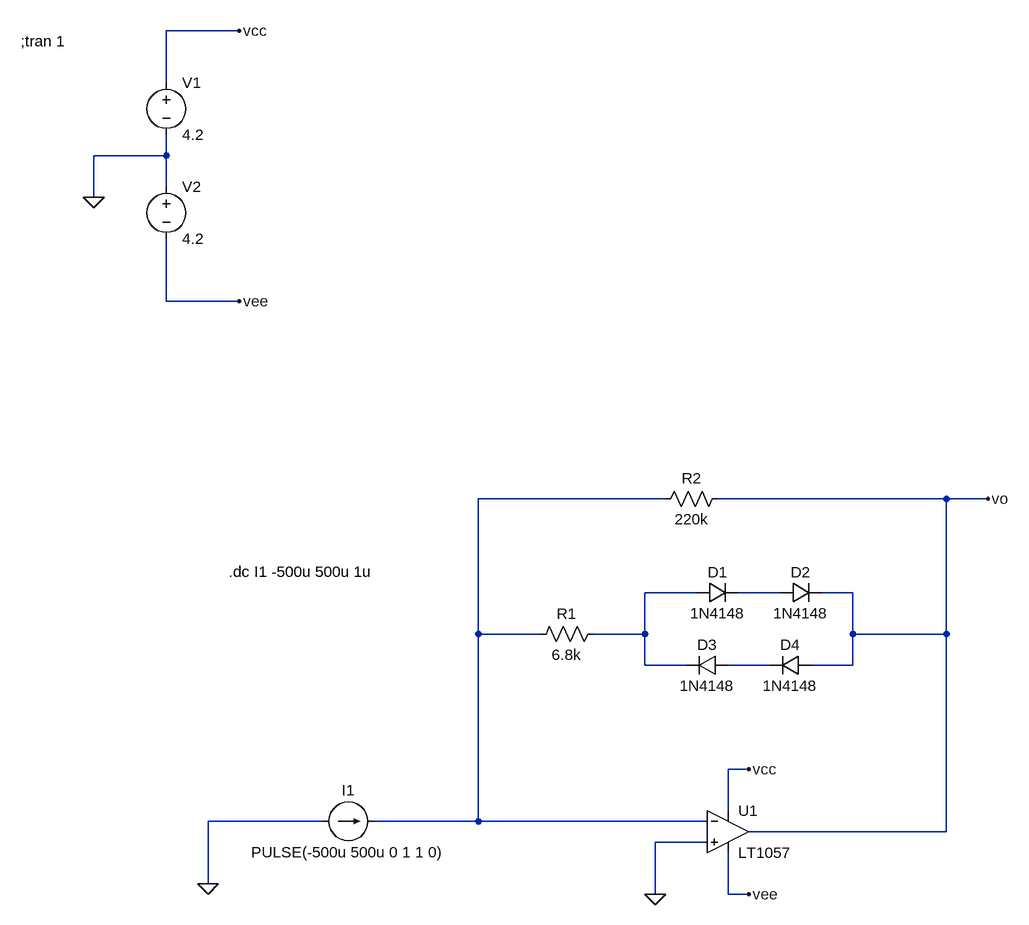
[diagram p0: schematic clipper_vi_curve.asc]
clipper_vi_curve.asc, the LTspice schematic file:
Version 4
SHEET 1 880 680
WIRE -608 -832 -720 -832
WIRE -720 -752 -720 -832
WIRE -720 -640 -720 -672
WIRE -720 -640 -832 -640
WIRE -720 -592 -720 -640
WIRE -832 -576 -832 -640
WIRE -720 -416 -720 -512
WIRE -608 -416 -720 -416
WIRE 48 -112 -240 -112
WIRE 480 -112 128 -112
WIRE 544 -112 480 -112
WIRE 96 32 16 32
WIRE 224 32 160 32
WIRE 336 32 288 32
WIRE -240 96 -240 -112
WIRE -144 96 -240 96
WIRE 16 96 16 32
WIRE 16 96 -64 96
WIRE 336 96 336 32
WIRE 480 96 480 -112
WIRE 480 96 336 96
WIRE 16 144 16 96
WIRE 80 144 16 144
WIRE 208 144 144 144
WIRE 336 144 336 96
WIRE 336 144 272 144
WIRE 176 304 144 304
WIRE 144 368 144 304
WIRE -480 384 -656 384
WIRE -240 384 -240 96
WIRE -240 384 -400 384
WIRE 112 384 -240 384
WIRE 480 400 480 96
WIRE 480 400 176 400
WIRE 112 416 32 416
WIRE -656 480 -656 384
WIRE 32 496 32 416
WIRE 144 496 144 432
WIRE 176 496 144 496
FLAG 32 496 0
FLAG 176 304 vcc
FLAG 176 496 vee
FLAG -656 480 0
FLAG -832 -576 0
FLAG -608 -832 vcc
FLAG -608 -416 vee
FLAG 544 -112 vo
SYMBOL diode 224 48 R270
WINDOW 0 32 32 VTop 2
WINDOW 3 0 32 VBottom 2
SYMATTR InstName D2
SYMATTR Value 1N4148
SYMBOL diode 96 48 R270
WINDOW 0 32 32 VTop 2
WINDOW 3 0 32 VBottom 2
SYMATTR InstName D1
SYMATTR Value 1N4148
SYMBOL diode 144 128 R90
WINDOW 0 0 32 VBottom 2
WINDOW 3 32 32 VTop 2
SYMATTR InstName D3
SYMATTR Value 1N4148
SYMBOL diode 272 128 R90
WINDOW 0 0 32 VBottom 2
WINDOW 3 32 32 VTop 2
SYMATTR InstName D4
SYMATTR Value 1N4148
SYMBOL res -48 80 R90
WINDOW 0 0 56 VBottom 2
WINDOW 3 32 56 VTop 2
SYMATTR InstName R1
SYMATTR Value 6.8k
SYMBOL res 144 -128 R90
WINDOW 0 0 56 VBottom 2
WINDOW 3 32 56 VTop 2
SYMATTR InstName R2
SYMATTR Value 220k
SYMBOL Opamps\\LT1057 144 336 R0
SYMATTR InstName U1
SYMBOL current -480 384 R270
WINDOW 0 32 40 VTop 2
WINDOW 3 -32 40 VBottom 2
WINDOW 123 0 0 Left 2
WINDOW 39 0 0 Left 2
SYMATTR InstName I1
SYMATTR Value PULSE(-500u 500u 0 1 1 0)
SYMBOL voltage -720 -768 R0
WINDOW 123 0 0 Left 2
WINDOW 39 0 0 Left 2
SYMATTR InstName V1
SYMATTR Value 4.2
SYMBOL voltage -720 -608 R0
WINDOW 123 0 0 Left 2
WINDOW 39 0 0 Left 2
SYMATTR InstName V2
SYMATTR Value 4.2
TEXT -944 -816 Left 2 !;tran 1
TEXT -624 0 Left 2 !.dc I1 -500u 500u 1u

The netlist it stands for:
* clipper_vi_curve.asc
D2 N003 vo 1N4148
D1 N002 N003 1N4148
D3 N004 N002 1N4148
D4 vo N004 1N4148
R1 N002 N001 6.8k
R2 vo N001 220k
XU1 0 N001 vcc vee vo LT1057  ; pins In+ In- V+ V- OUT
I1 0 N001 PULSE(-500u 500u 0 1 1 0)
V1 vcc 0 4.2
V2 0 vee 4.2
.model D D
.lib standard.dio
;tran 1
.dc I1 -500u 500u 1u
.lib LTC.lib
.backanno
.end